# EAGLE design button_brick (EAGLE 7.2.0)
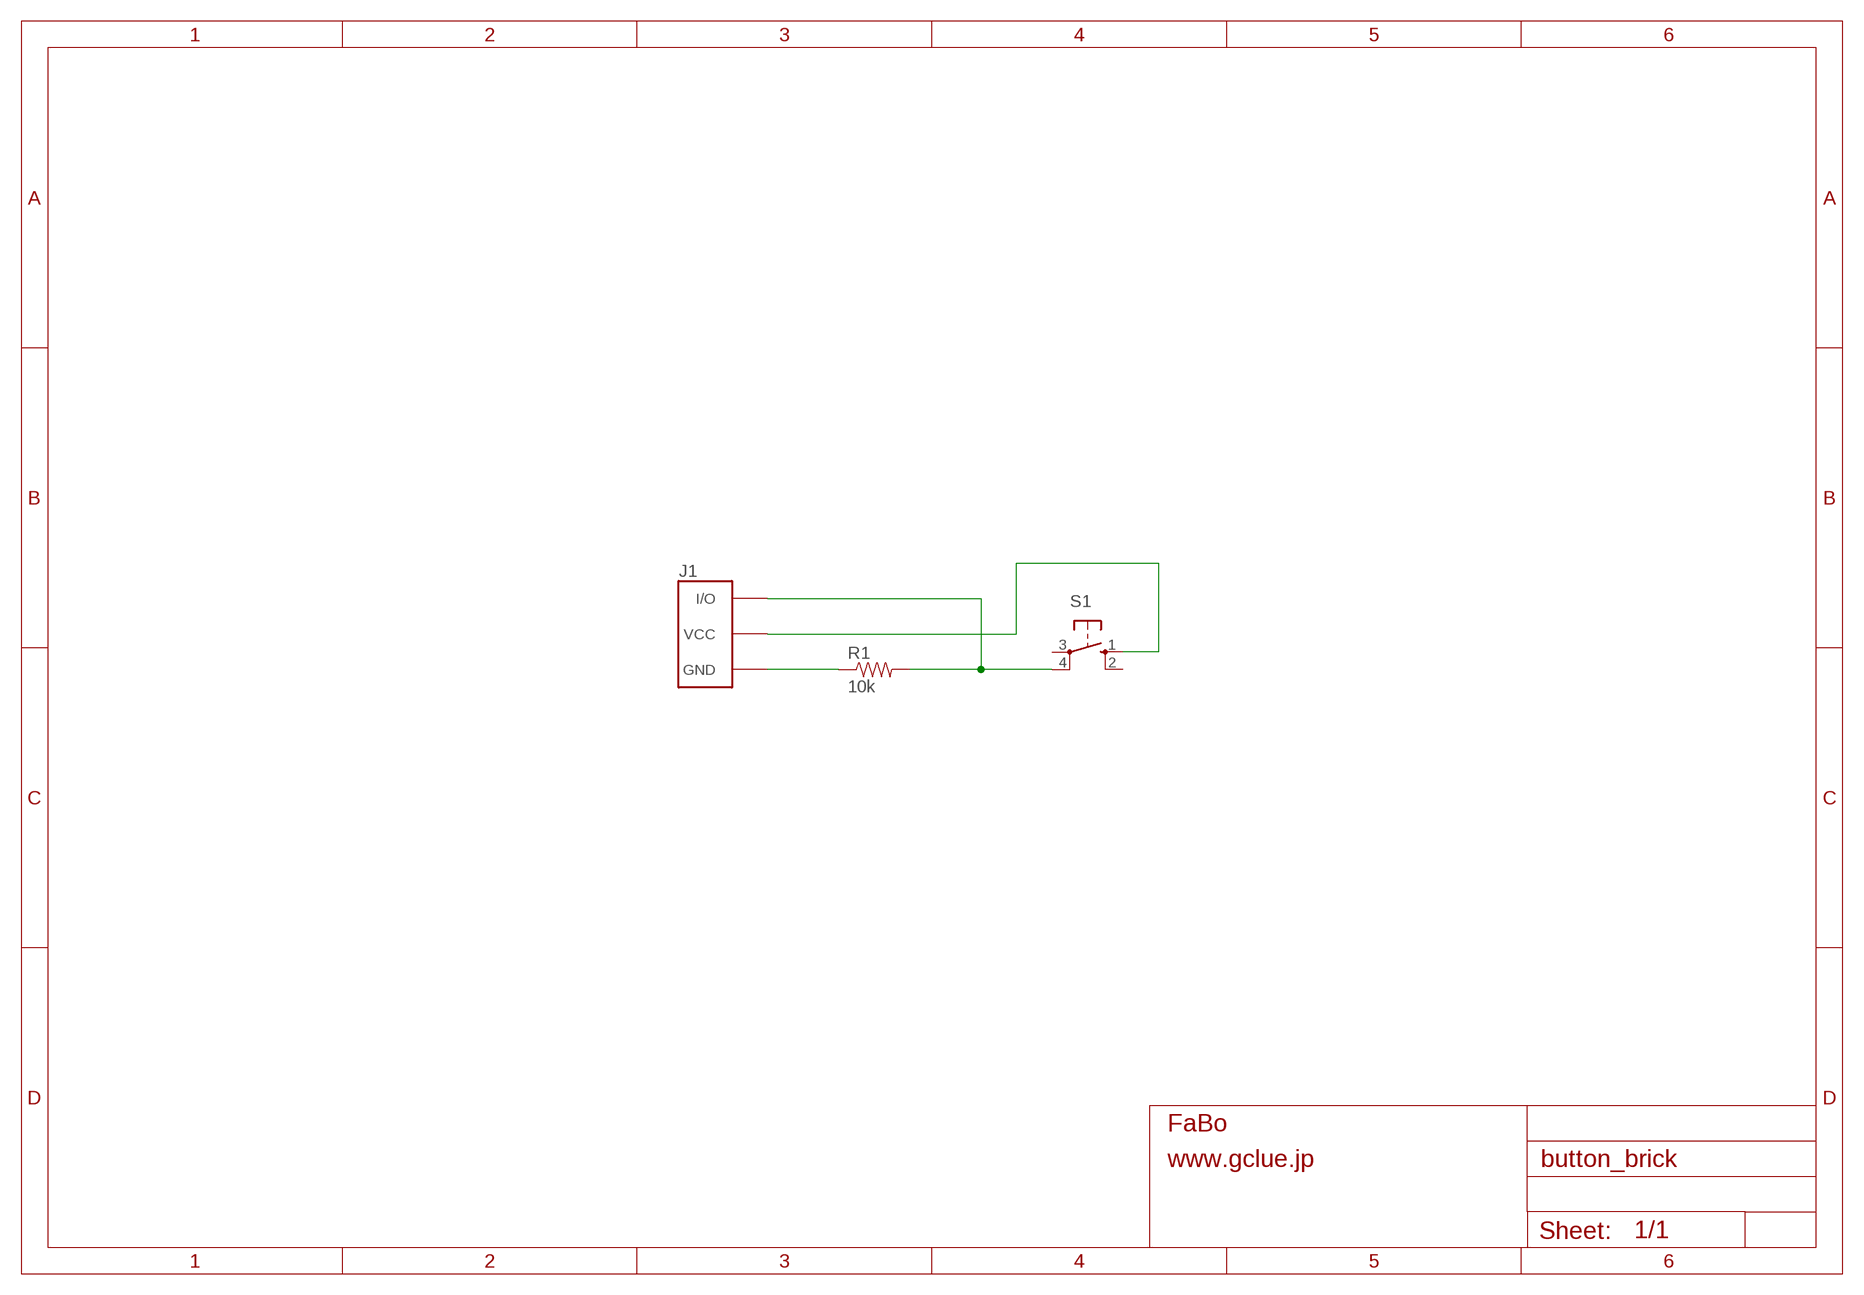
[diagram p0: schematic, sheet 1]

## Parts
J1  BRICK_3PIN  [BRICK_3PIN]
R1  10k  RESISTORPTH-1/4W  [AXIAL-0.4]
S1  10-XX  [B3F-10XX]

## Nets
GND: J1.GND R1.P$1
N$1: J1.VCC S1.1(S)
N$4: J1.IN/OUT(I/O) R1.P$2 S1.4(P1)
Unconnected: S1.2(S1) S1.3(P)

## Library data of the parts
J1 = gclue:BRICK_3PIN: FaBo Brick 3pin
R1 = SparkFun-Resistors:RESISTOR: Resistor Basic schematic elements and footprints for 0603, 1206, and PTH resistors.
S1 = switch-omron:10-XX: OMRON SWITCH; MPN: B3F-1000; OC_FARNELL: 176432; OC_NEWARK: 36M3542

## Board
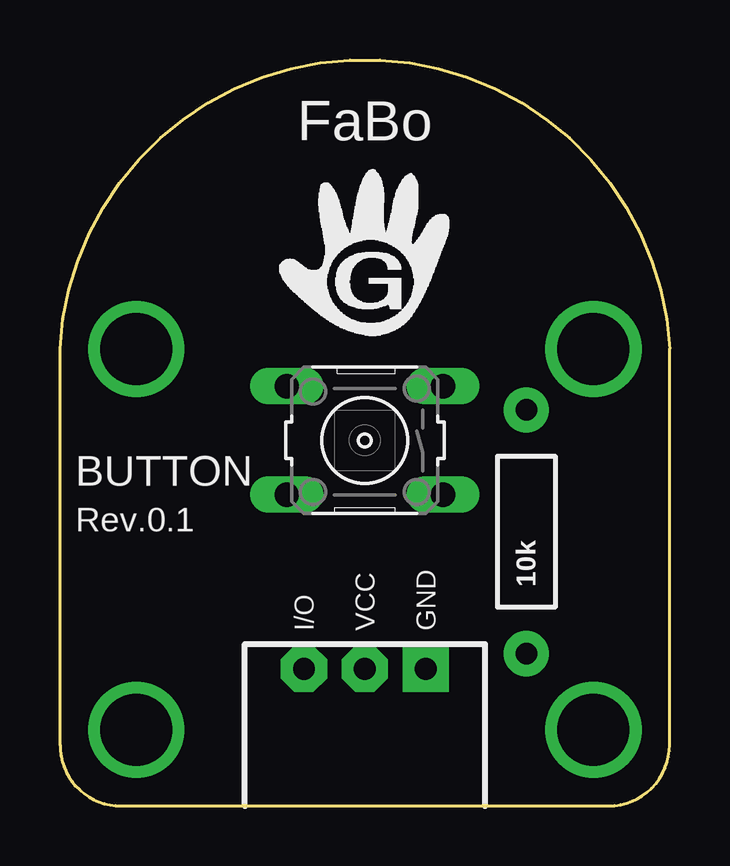
[diagram p1: board, top side]
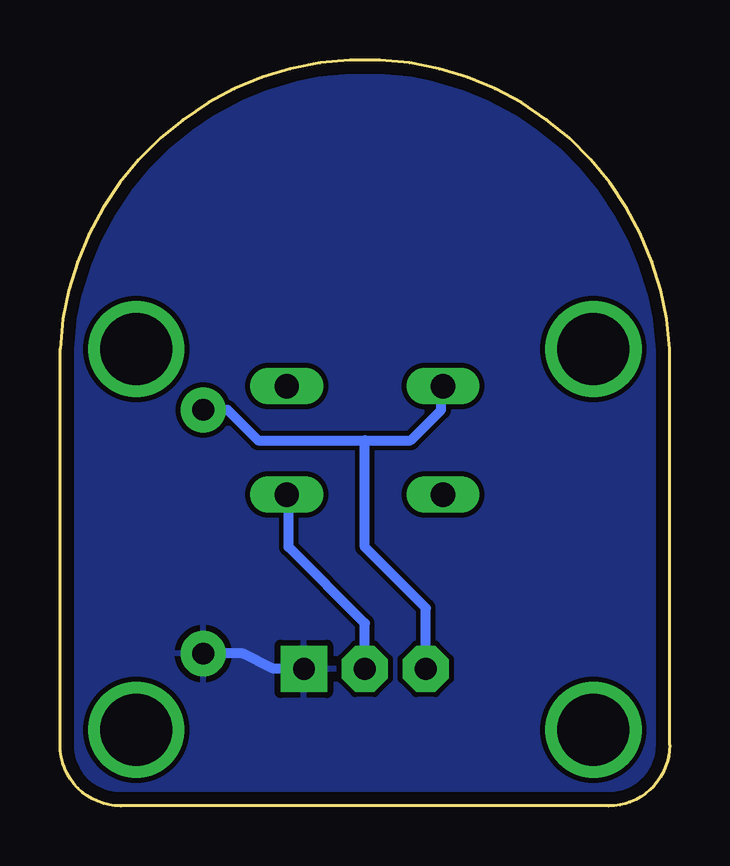
[diagram p2: board, bottom side, seen from below]

Size 25.4 x 31.1 mm. Coordinates in mm from the lower left corner, seen from the top.
Copper layers (1*16): Top 0.035mm / dielectric 1.5mm / Bottom 0.035mm
Design rules "default *": minimum track width 10mil, minimum drill 24mil, track to track 8mil, track to pad 8mil, pad to pad 8mil, via to via 8mil, smd to smd 8mil, copper to edge 20mil, drill to drill 8mil, minimum pad ring 10mil, minimum via ring 8mil, stop-mask expansion 4mil, vias tented up to drill 0mil, thermal gap 10mil

### Footprints (pad centres in the part's own frame; a part is rotated, then mirrored left to right if it is on the bottom)
BRICK_3PIN = drill 0.9 pad 1.93 square: GND 2.54,-9.525 | drill 0.9 pad 1.93 octagon: IN/OUT -2.54,-9.525; VCC 0,-9.525 | drill 3 pad 3.81: P$1 -9.525,3.81; P$2 9.525,3.81; P$3 9.525,-12.065; P$4 -9.525,-12.065
AXIAL-0.4 = drill 0.9 pad 1.88: P$1 -5.08,0; P$2 5.08,0
B3F-10XX = drill 1.016 long: 1 -3.251,2.261; 2 3.251,2.261; 3 -3.251,-2.261; 4 3.251,-2.261

### Placement (x,y rotation side)
J1  12.7,15.24 0 top
R1  19.43,11.43 90 top
S1  Button  [B3F-10XX]  12.7,15.24 180 top

### Tracks (layer width: path | path; a pad name or v marks a point on that pad's centre or on a via)
GND
  Bottom 0.406: J1.GND 16.51,5.71 17.78,6.35 R1.P$1
  pour Bottom: -0.64,-0.63 26.04,-0.63 26.04,31.75 -0.64,31.75
N$1
  Bottom 0.406: J1.VCC 12.7,7.62 15.88,10.79 15.88,12.7 S1.1
N$4
  Bottom 0.406: J1.IN/OUT 10.16,8.26 12.7,10.79 12.7,15.24 | 12.7,15.24 10.79,15.24 9.52,16.51 9.52,17.15 S1.4 | R1.P$2 18.41,16.51 17.14,15.24 12.7,15.24

### Text on the board
tPlace: BUTTON | Rev.0.1